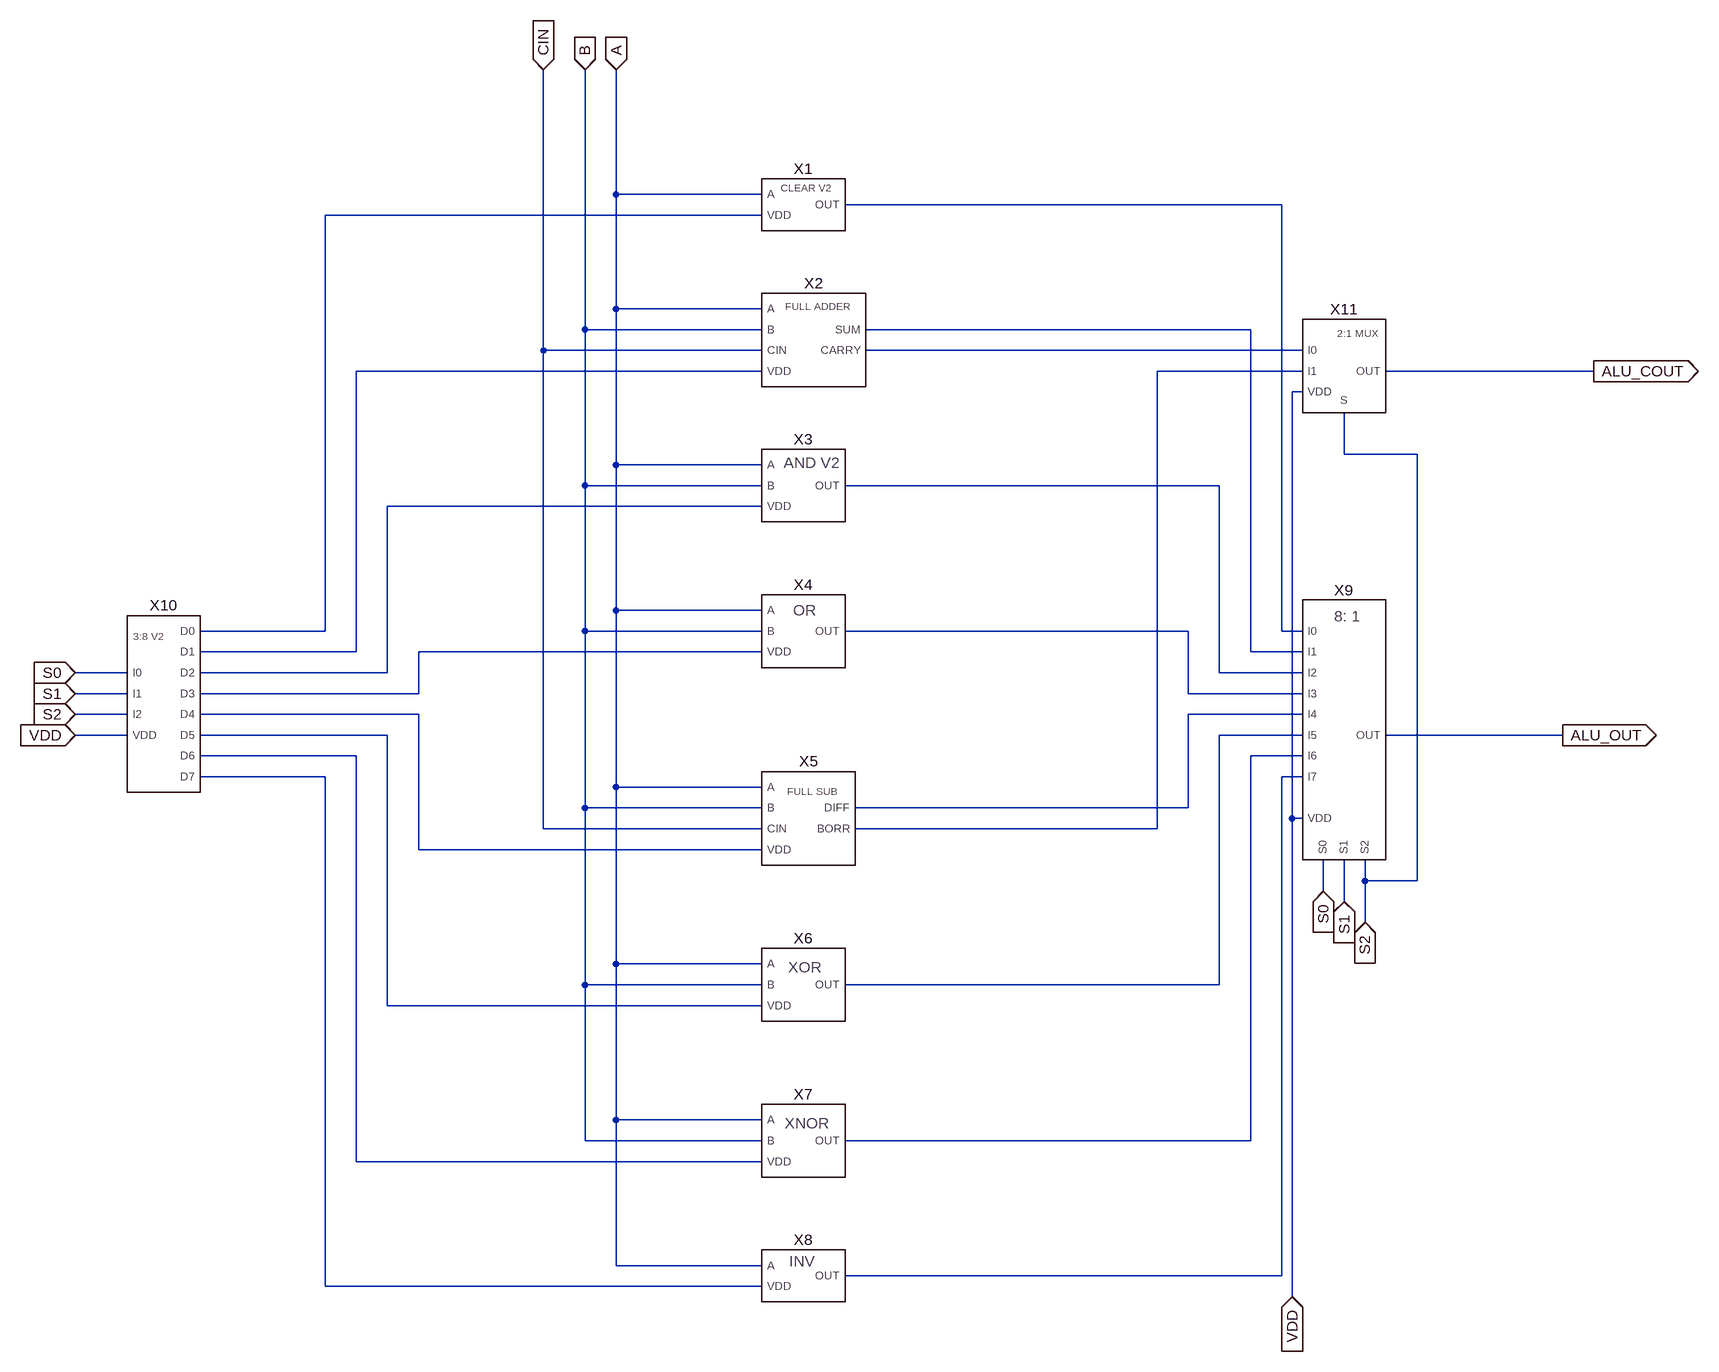
[diagram p0: schematic OneBitALU_V2.asc]
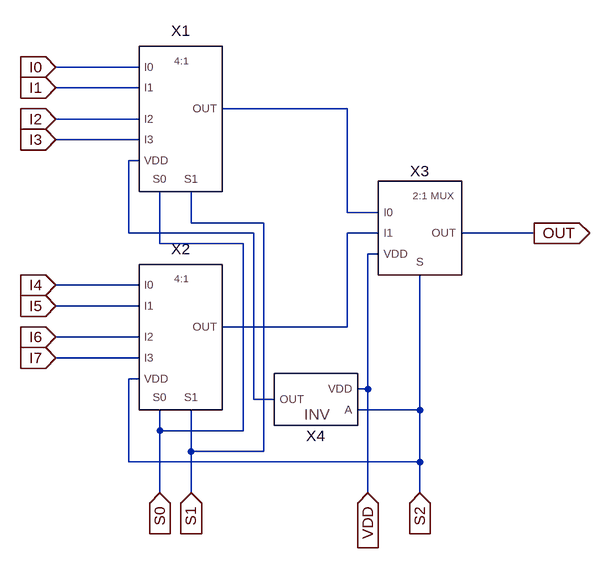
[diagram p1: sub-circuit mux8to1.asc]
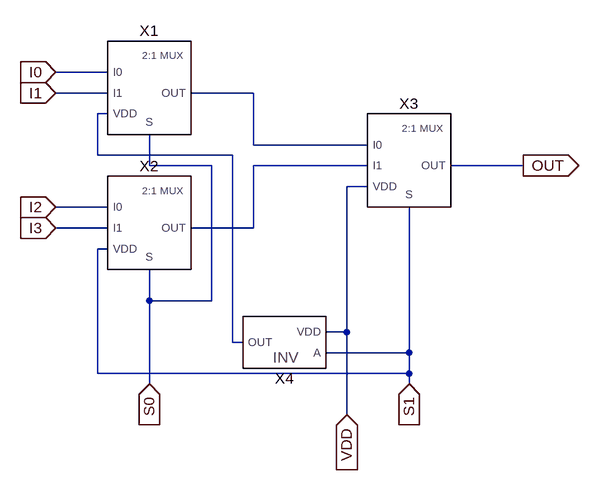
[diagram p2: sub-circuit mux4to1.asc]
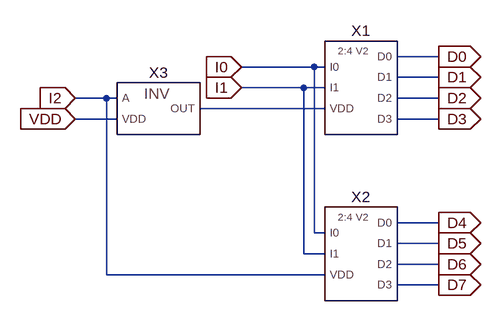
[diagram p3: sub-circuit dec3to8_v2.asc]
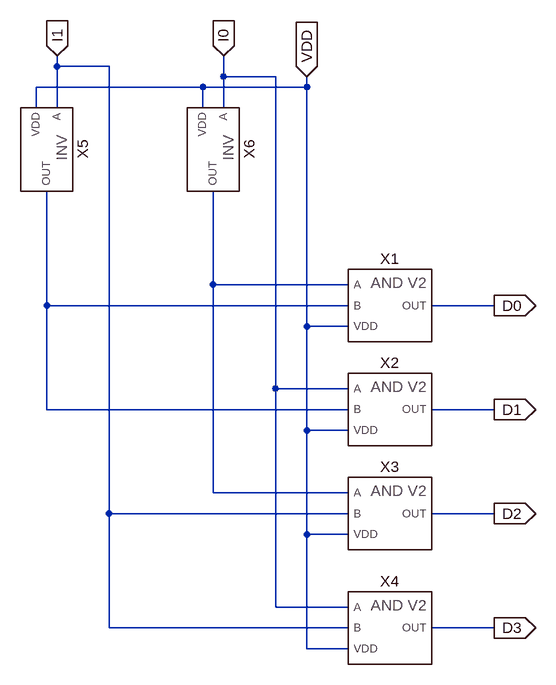
[diagram p4: sub-circuit dec2to4_v2.asc]
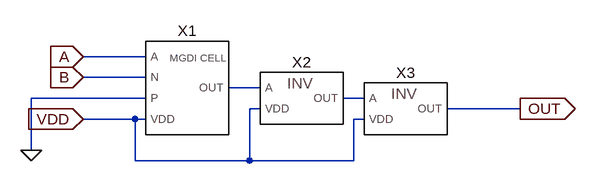
[diagram p5: sub-circuit and_v2.asc]
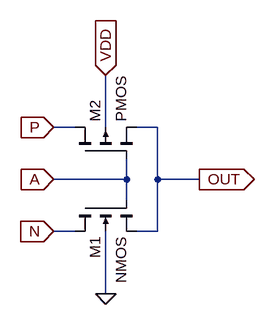
[diagram p6: sub-circuit gdicell.asc]
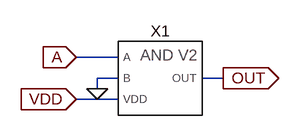
[diagram p7: sub-circuit clear_v2.asc]
OneBitALU_V2.asc, the LTspice schematic file:
Version 4
SHEET 1 2344 1868
WIRE -96 64 -96 -128
WIRE 128 64 -96 64
WIRE 928 80 256 80
WIRE 128 96 -544 96
WIRE -96 240 -96 64
WIRE 128 240 -96 240
WIRE -144 272 -144 -128
WIRE 128 272 -144 272
WIRE 880 272 288 272
WIRE -208 304 -208 -128
WIRE 128 304 -208 304
WIRE 960 304 288 304
WIRE 128 336 -496 336
WIRE 960 336 736 336
WIRE 1408 336 1088 336
WIRE 960 368 944 368
WIRE 1024 464 1024 400
WIRE 1136 464 1024 464
WIRE -96 480 -96 240
WIRE 128 480 -96 480
WIRE -144 512 -144 272
WIRE 128 512 -144 512
WIRE 832 512 256 512
WIRE 128 544 -448 544
WIRE -96 704 -96 480
WIRE 128 704 -96 704
WIRE -544 736 -544 96
WIRE -544 736 -736 736
WIRE -144 736 -144 512
WIRE 128 736 -144 736
WIRE 784 736 256 736
WIRE 928 736 928 80
WIRE 960 736 928 736
WIRE -496 768 -496 336
WIRE -496 768 -736 768
WIRE 128 768 -400 768
WIRE 880 768 880 272
WIRE 960 768 880 768
WIRE -848 800 -928 800
WIRE -448 800 -448 544
WIRE -448 800 -736 800
WIRE 832 800 832 512
WIRE 960 800 832 800
WIRE -848 832 -928 832
WIRE -400 832 -400 768
WIRE -400 832 -736 832
WIRE 784 832 784 736
WIRE 960 832 784 832
WIRE -848 864 -928 864
WIRE -400 864 -736 864
WIRE 960 864 784 864
WIRE -848 896 -928 896
WIRE -448 896 -736 896
WIRE 960 896 832 896
WIRE 1360 896 1088 896
WIRE -496 928 -736 928
WIRE 960 928 880 928
WIRE -544 960 -736 960
WIRE 960 960 928 960
WIRE -96 976 -96 704
WIRE 128 976 -96 976
WIRE -144 1008 -144 736
WIRE 128 1008 -144 1008
WIRE 784 1008 784 864
WIRE 784 1008 272 1008
WIRE 944 1024 944 368
WIRE 960 1024 944 1024
WIRE -208 1040 -208 304
WIRE 128 1040 -208 1040
WIRE 736 1040 736 336
WIRE 736 1040 272 1040
WIRE -400 1072 -400 864
WIRE 128 1072 -400 1072
WIRE 1056 1120 1056 1088
WIRE 1136 1120 1136 464
WIRE 1136 1120 1056 1120
WIRE 992 1136 992 1088
WIRE 1024 1152 1024 1088
WIRE 1056 1184 1056 1120
WIRE -96 1248 -96 976
WIRE 128 1248 -96 1248
WIRE -144 1280 -144 1008
WIRE 128 1280 -144 1280
WIRE 832 1280 832 896
WIRE 832 1280 256 1280
WIRE -448 1312 -448 896
WIRE 128 1312 -448 1312
WIRE -96 1488 -96 1248
WIRE 128 1488 -96 1488
WIRE -144 1520 -144 1280
WIRE 128 1520 -144 1520
WIRE 880 1520 880 928
WIRE 880 1520 256 1520
WIRE -496 1552 -496 928
WIRE 128 1552 -496 1552
WIRE -96 1712 -96 1488
WIRE 128 1712 -96 1712
WIRE 928 1728 928 960
WIRE 928 1728 256 1728
WIRE -544 1744 -544 960
WIRE 128 1744 -544 1744
WIRE 944 1760 944 1024
FLAG -96 -128 A
IOPIN -96 -128 In
FLAG -144 -128 B
IOPIN -144 -128 In
FLAG -208 -128 CIN
IOPIN -208 -128 In
FLAG -928 800 S0
IOPIN -928 800 In
FLAG -928 832 S1
IOPIN -928 832 In
FLAG -928 864 S2
IOPIN -928 864 In
FLAG -928 896 VDD
IOPIN -928 896 In
FLAG 1056 1184 S2
IOPIN 1056 1184 In
FLAG 992 1136 S0
IOPIN 992 1136 In
FLAG 1024 1152 S1
IOPIN 1024 1152 In
FLAG 944 1760 VDD
IOPIN 944 1760 In
FLAG 1360 896 ALU_OUT
IOPIN 1360 896 Out
FLAG 1408 336 ALU_COUT
IOPIN 1408 336 Out
SYMBOL FULLADDER 208 288 R0
SYMATTR InstName X2
SYMBOL ORgdi 192 736 R0
SYMATTR InstName X4
SYMBOL FULLSUB 192 1024 R0
SYMATTR InstName X5
SYMBOL XORgdi 192 1280 R0
SYMATTR InstName X6
SYMBOL XNORgdi 192 1520 R0
SYMATTR InstName X7
SYMBOL INVgdi 192 1728 R0
SYMATTR InstName X8
SYMBOL MUX8to1 1024 896 R0
SYMATTR InstName X9
SYMBOL MUX2to1 1024 336 R0
SYMATTR InstName X11
SYMBOL dec3to8_V2 -800 848 R0
SYMATTR InstName X10
SYMBOL AND_V2 192 512 R0
SYMATTR InstName X3
SYMBOL CLEAR_V2 192 80 R0
SYMATTR InstName X1

mux8to1.asc, the sub-circuit schematic file:
Version 4
SHEET 1 880 812
WIRE 112 48 -16 48
WIRE 112 80 -16 80
WIRE 432 112 240 112
WIRE 112 128 -16 128
WIRE 112 160 -16 160
WIRE 112 192 96 192
WIRE 432 272 432 112
WIRE 480 272 432 272
WIRE 192 288 192 240
WIRE 304 288 192 288
WIRE 96 304 96 192
WIRE 288 304 96 304
WIRE 480 304 432 304
WIRE 720 304 608 304
WIRE 144 320 144 240
WIRE 272 320 144 320
WIRE 480 336 464 336
WIRE 112 384 -16 384
WIRE 112 416 -16 416
WIRE 432 448 432 304
WIRE 432 448 240 448
WIRE 112 464 -16 464
WIRE 112 496 -16 496
WIRE 112 528 96 528
WIRE 464 544 464 336
WIRE 464 544 448 544
WIRE 288 560 288 304
WIRE 320 560 288 560
WIRE 544 576 544 368
WIRE 544 576 448 576
WIRE 144 608 144 576
WIRE 272 608 272 320
WIRE 272 608 144 608
WIRE 192 640 192 576
WIRE 304 640 304 288
WIRE 304 640 192 640
WIRE 96 656 96 528
WIRE 544 656 544 576
WIRE 544 656 96 656
WIRE 144 704 144 608
WIRE 192 704 192 640
WIRE 464 704 464 544
WIRE 544 704 544 656
FLAG -16 48 I0
IOPIN -16 48 In
FLAG -16 80 I1
IOPIN -16 80 In
FLAG -16 128 I2
IOPIN -16 128 In
FLAG -16 160 I3
IOPIN -16 160 In
FLAG -16 384 I4
IOPIN -16 384 In
FLAG -16 416 I5
IOPIN -16 416 In
FLAG -16 464 I6
IOPIN -16 464 In
FLAG -16 496 I7
IOPIN -16 496 In
FLAG 144 704 S0
IOPIN 144 704 In
FLAG 192 704 S1
IOPIN 192 704 In
FLAG 544 704 S2
IOPIN 544 704 In
FLAG 464 704 VDD
IOPIN 464 704 In
FLAG 720 304 OUT
IOPIN 720 304 Out
SYMBOL MUX4to1 176 128 R0
SYMATTR InstName X1
SYMBOL MUX4to1 176 464 R0
SYMATTR InstName X2
SYMBOL MUX2to1 544 304 R0
SYMATTR InstName X3
SYMBOL INVgdi 384 560 R180
SYMATTR InstName X4

mux4to1.asc, the sub-circuit schematic file:
Version 4
SHEET 1 880 684
WIRE 96 48 16 48
WIRE 96 80 16 80
WIRE 320 80 224 80
WIRE 96 112 80 112
WIRE 320 160 320 80
WIRE 496 160 320 160
WIRE 80 176 80 112
WIRE 288 176 80 176
WIRE 160 192 160 144
WIRE 256 192 160 192
WIRE 496 192 320 192
WIRE 736 192 624 192
WIRE 496 224 464 224
WIRE 96 256 16 256
WIRE 96 288 16 288
WIRE 320 288 320 192
WIRE 320 288 224 288
WIRE 96 320 80 320
WIRE 160 400 160 352
WIRE 256 400 256 192
WIRE 256 400 160 400
WIRE 464 448 464 224
WIRE 464 448 432 448
WIRE 288 464 288 176
WIRE 304 464 288 464
WIRE 560 480 560 256
WIRE 560 480 432 480
WIRE 80 512 80 320
WIRE 560 512 560 480
WIRE 560 512 80 512
WIRE 160 528 160 400
WIRE 560 528 560 512
WIRE 464 576 464 448
FLAG 16 48 I0
IOPIN 16 48 In
FLAG 16 80 I1
IOPIN 16 80 In
FLAG 16 256 I2
IOPIN 16 256 In
FLAG 16 288 I3
IOPIN 16 288 In
FLAG 736 192 OUT
IOPIN 736 192 Out
FLAG 160 528 S0
IOPIN 160 528 In
FLAG 560 528 S1
IOPIN 560 528 In
FLAG 464 576 VDD
IOPIN 464 576 In
SYMBOL MUX2to1 160 80 R0
SYMATTR InstName X1
SYMBOL MUX2to1 160 288 R0
SYMATTR InstName X2
SYMBOL MUX2to1 560 192 R0
SYMATTR InstName X3
SYMBOL INVgdi 368 464 R180
SYMATTR InstName X4

dec3to8_v2.asc, the sub-circuit schematic file:
Version 4
SHEET 1 880 680
WIRE 368 -320 304 -320
WIRE 176 -304 64 -304
WIRE 192 -304 176 -304
WIRE 368 -288 304 -288
WIRE 160 -272 64 -272
WIRE 192 -272 160 -272
WIRE -144 -256 -192 -256
WIRE -128 -256 -144 -256
WIRE 368 -256 304 -256
WIRE 192 -240 0 -240
WIRE -128 -224 -192 -224
WIRE 368 -224 304 -224
WIRE 368 -64 304 -64
WIRE 176 -48 176 -304
WIRE 192 -48 176 -48
WIRE 368 -32 304 -32
WIRE 160 -16 160 -272
WIRE 192 -16 160 -16
WIRE 368 0 304 0
WIRE -144 16 -144 -256
WIRE 192 16 -144 16
WIRE 368 32 304 32
FLAG 64 -304 I0
IOPIN 64 -304 In
FLAG 64 -272 I1
IOPIN 64 -272 In
FLAG -192 -256 I2
IOPIN -192 -256 In
FLAG -192 -224 VDD
IOPIN -192 -224 In
FLAG 368 -320 D0
IOPIN 368 -320 Out
FLAG 368 -288 D1
IOPIN 368 -288 Out
FLAG 368 -256 D2
IOPIN 368 -256 Out
FLAG 368 -224 D3
IOPIN 368 -224 Out
FLAG 368 -64 D4
IOPIN 368 -64 Out
FLAG 368 -32 D5
IOPIN 368 -32 Out
FLAG 368 0 D6
IOPIN 368 0 Out
FLAG 368 32 D7
IOPIN 368 32 Out
SYMBOL dec2to4_V2 240 -272 R0
SYMATTR InstName X1
SYMBOL dec2to4_V2 240 -16 R0
SYMATTR InstName X2
SYMBOL INVgdi -64 -240 R0
SYMATTR InstName X3

dec2to4_v2.asc, the sub-circuit schematic file:
Version 4
SHEET 1 1500 776
WIRE -224 -336 -224 -352
WIRE -144 -336 -224 -336
WIRE 32 -320 32 -352
WIRE 112 -320 32 -320
WIRE 0 -304 -256 -304
WIRE 160 -304 160 -320
WIRE 160 -304 0 -304
WIRE -256 -272 -256 -304
WIRE -224 -272 -224 -336
WIRE 0 -272 0 -304
WIRE 32 -272 32 -320
WIRE 16 0 16 -144
WIRE 224 0 16 0
WIRE -240 32 -240 -144
WIRE 224 32 -240 32
WIRE 448 32 352 32
WIRE 160 64 160 -304
WIRE 224 64 160 64
WIRE 112 160 112 -320
WIRE 224 160 112 160
WIRE -240 192 -240 32
WIRE 224 192 -240 192
WIRE 448 192 352 192
WIRE 160 224 160 64
WIRE 224 224 160 224
WIRE 16 320 16 0
WIRE 224 320 16 320
WIRE -144 352 -144 -336
WIRE 224 352 -144 352
WIRE 448 352 352 352
WIRE 160 384 160 224
WIRE 224 384 160 384
WIRE 112 496 112 160
WIRE 224 496 112 496
WIRE -144 528 -144 352
WIRE 224 528 -144 528
WIRE 448 528 352 528
WIRE 160 560 160 384
WIRE 224 560 160 560
FLAG -224 -352 I1
IOPIN -224 -352 In
FLAG 32 -352 I0
IOPIN 32 -352 In
FLAG 160 -320 VDD
IOPIN 160 -320 In
FLAG 448 32 D0
IOPIN 448 32 Out
FLAG 448 192 D1
IOPIN 448 192 Out
FLAG 448 352 D2
IOPIN 448 352 Out
FLAG 448 528 D3
IOPIN 448 528 Out
SYMBOL INVgdi -240 -208 R90
SYMATTR InstName X5
SYMBOL INVgdi 16 -208 R90
SYMATTR InstName X6
SYMBOL AND_V2 288 32 R0
SYMATTR InstName X1
SYMBOL AND_V2 288 192 R0
SYMATTR InstName X2
SYMBOL AND_V2 288 352 R0
SYMATTR InstName X3
SYMBOL AND_V2 288 528 R0
SYMATTR InstName X4

and_v2.asc, the sub-circuit schematic file:
Version 4
SHEET 1 880 680
WIRE -32 192 -128 192
WIRE -32 224 -128 224
WIRE 144 240 96 240
WIRE -32 256 -208 256
WIRE 304 256 272 256
WIRE 144 272 128 272
WIRE 544 272 432 272
WIRE -48 288 -128 288
WIRE -32 288 -48 288
WIRE 304 288 288 288
WIRE -208 336 -208 256
WIRE -48 352 -48 288
WIRE 128 352 128 272
WIRE 128 352 -48 352
WIRE 288 352 288 288
WIRE 288 352 128 352
FLAG -128 192 A
IOPIN -128 192 In
FLAG -128 224 B
IOPIN -128 224 In
FLAG -128 288 VDD
IOPIN -128 288 In
FLAG 544 272 OUT
IOPIN 544 272 Out
FLAG -208 336 0
SYMBOL GDICell 32 240 R0
SYMATTR InstName X1
SYMBOL INVgdi 208 256 R0
SYMATTR InstName X2
SYMBOL INVgdi 368 272 R0
SYMATTR InstName X3

gdicell.asc, the sub-circuit schematic file:
Version 4
SHEET 1 1484 2272
WIRE 176 96 144 96
WIRE 224 96 224 16
WIRE 304 96 272 96
WIRE 256 176 256 144
WIRE 256 176 144 176
WIRE 304 176 304 96
WIRE 368 176 304 176
WIRE 256 208 256 176
WIRE 176 256 144 256
WIRE 304 256 304 176
WIRE 304 256 272 256
WIRE 224 352 224 256
FLAG 144 96 P
IOPIN 144 96 In
FLAG 144 256 N
IOPIN 144 256 In
FLAG 144 176 A
IOPIN 144 176 In
FLAG 368 176 OUT
IOPIN 368 176 Out
FLAG 224 16 VDD
IOPIN 224 16 In
FLAG 224 352 0
SYMBOL nmos4 176 208 M90
SYMATTR InstName M1
SYMATTR Value2 l=65nm w=65nm
SYMBOL pmos4 176 144 R270
SYMATTR InstName M2
SYMATTR Value2 l=65nm w=162.5nm

clear_v2.asc, the sub-circuit schematic file:
Version 4
SHEET 1 880 680
WIRE 160 128 96 128
WIRE 160 160 128 160
WIRE 320 160 288 160
WIRE 128 176 128 160
WIRE 160 192 96 192
FLAG 128 176 0
FLAG 96 128 A
IOPIN 96 128 In
FLAG 96 192 VDD
IOPIN 96 192 In
FLAG 320 160 OUT
IOPIN 320 160 Out
SYMBOL AND_V2 224 160 R0
SYMATTR InstName X1

The netlist it stands for:
* OneBitALU_V2.asc
XX2 A B CIN N005 N004 N003 FULLADDER  ; pins A B CIN VDD CARRY SUM
XX4 A B N010 N009 ORgdi  ; pins A B VDD OUT
XX5 A B CIN N011 N006 N012 FULLSUB  ; pins A B CIN VDD BORR DIFF
XX6 A B N013 N014 XORgdi  ; pins A B VDD OUT
XX7 A B N015 N016 XNORgdi  ; pins A B VDD OUT
XX8 A N017 N018 INVgdi  ; pins A VDD OUT
XX9 N001 N003 N007 N009 N012 N014 N016 N018 S0 S1 S2 VDD ALU_OUT mux8to1
XX11 N004 N006 S2 VDD ALU_COUT MUX2to1  ; pins I0 I1 S VDD OUT
XX10 S0 S1 S2 VDD N002 N005 N008 N010 N011 N013 N015 N017 dec3to8_v2
XX3 A B N008 N007 and_v2
XX1 A N002 N001 clear_v2

* block symbol definitions
.subckt mux8to1 I0 I1 I2 I3 I4 I5 I6 I7 S0 S1 S2 VDD OUT
XX1 I0 I1 I2 I3 S0 S1 N002 N001 mux4to1
XX2 I4 I5 I6 I7 S0 S1 S2 N003 mux4to1
XX3 N001 N003 S2 VDD OUT MUX2to1  ; pins I0 I1 S VDD OUT
XX4 S2 VDD N002 INVgdi  ; pins A VDD OUT
.ends mux8to1

.subckt mux4to1 I0 I1 I2 I3 S0 S1 VDD OUT
XX1 I0 I1 S0 N002 N001 MUX2to1  ; pins I0 I1 S VDD OUT
XX2 I2 I3 S0 S1 N003 MUX2to1  ; pins I0 I1 S VDD OUT
XX3 N001 N003 S1 VDD OUT MUX2to1  ; pins I0 I1 S VDD OUT
XX4 S1 VDD N002 INVgdi  ; pins A VDD OUT
.ends mux4to1

.subckt dec3to8_v2 I0 I1 I2 VDD D0 D1 D2 D3 D4 D5 D6 D7
XX1 I0 I1 N001 D0 D1 D2 D3 dec2to4_v2
XX2 I0 I1 I2 D4 D5 D6 D7 dec2to4_v2
XX3 I2 VDD N001 INVgdi  ; pins A VDD OUT
.ends dec3to8_v2

.subckt dec2to4_v2 I0 I1 VDD D0 D1 D2 D3
XX5 I1 VDD N002 INVgdi  ; pins A VDD OUT
XX6 I0 VDD N001 INVgdi  ; pins A VDD OUT
XX1 N001 N002 VDD D0 and_v2
XX2 I0 N002 VDD D1 and_v2
XX3 N001 I1 VDD D2 and_v2
XX4 I0 I1 VDD D3 and_v2
.ends dec2to4_v2

.subckt and_v2 A B VDD OUT
XX1 A B 0 VDD N001 gdicell
XX2 N001 VDD N002 INVgdi  ; pins A VDD OUT
XX3 N002 VDD OUT INVgdi  ; pins A VDD OUT
.ends and_v2

.subckt gdicell A N P VDD OUT
M1 N A OUT 0 NMOS l=65nm w=65nm
M2 P A OUT VDD PMOS l=65nm w=162.5nm
.ends gdicell

.subckt clear_v2 A VDD OUT
XX1 A 0 VDD OUT and_v2
.ends clear_v2

.model NMOS NMOS
.model PMOS PMOS
.lib standard.mos
.backanno
.end